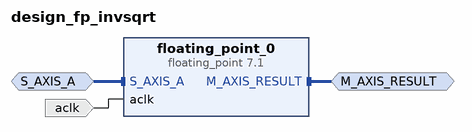
[diagram p0: block diagram of the top level]
# Vivado block design design_fp_invsqrt, xczu3eg-sbva484-1-i, Vivado 2018.3
create_bd_design design_fp_invsqrt

create_bd_intf_port -mode Master -vlnv xilinx.com:interface:axis_rtl:1.0 M_AXIS_RESULT
set_property -dict {CONFIG.FREQ_HZ 10000000} [get_bd_intf_ports M_AXIS_RESULT]
create_bd_intf_port -mode Slave -vlnv xilinx.com:interface:axis_rtl:1.0 S_AXIS_A
set_property -dict [list \
  CONFIG.FREQ_HZ 10000000 \
  CONFIG.HAS_TKEEP 0 \
  CONFIG.HAS_TLAST 0 \
  CONFIG.HAS_TREADY 0 \
  CONFIG.HAS_TSTRB 0 \
  CONFIG.LAYERED_METADATA undef \
  CONFIG.TDATA_NUM_BYTES 4 \
  CONFIG.TDEST_WIDTH 0 \
  CONFIG.TID_WIDTH 0 \
  CONFIG.TUSER_WIDTH 0 \
] [get_bd_intf_ports S_AXIS_A]
create_bd_port -dir I -type clk aclk
set_property -dict {CONFIG.FREQ_HZ 10000000} [get_bd_ports aclk]

create_bd_cell -type ip -vlnv xilinx.com:ip:floating_point:7.1 floating_point_0
set_property -dict [list \
  CONFIG.A_Precision_Type Single \
  CONFIG.C_Latency 20 \
  CONFIG.C_Mult_Usage Full_Usage \
  CONFIG.C_Rate 1 \
  CONFIG.C_Result_Exponent_Width 8 \
  CONFIG.C_Result_Fraction_Width 24 \
  CONFIG.Flow_Control NonBlocking \
  CONFIG.Has_RESULT_TREADY false \
  CONFIG.Maximum_Latency false \
  CONFIG.Operation_Type Rec_Square_Root \
  CONFIG.Result_Precision_Type Single \
] [get_bd_cells floating_point_0]

# ---- connections ----

connect_bd_intf_net [get_bd_intf_ports S_AXIS_A] [get_bd_intf_pins floating_point_0/S_AXIS_A]
connect_bd_intf_net [get_bd_intf_ports M_AXIS_RESULT] [get_bd_intf_pins floating_point_0/M_AXIS_RESULT]
connect_bd_net [get_bd_ports aclk] [get_bd_pins floating_point_0/aclk]

validate_bd_design
save_bd_design
